# Altium project ADE-2ASK.PrjPcb
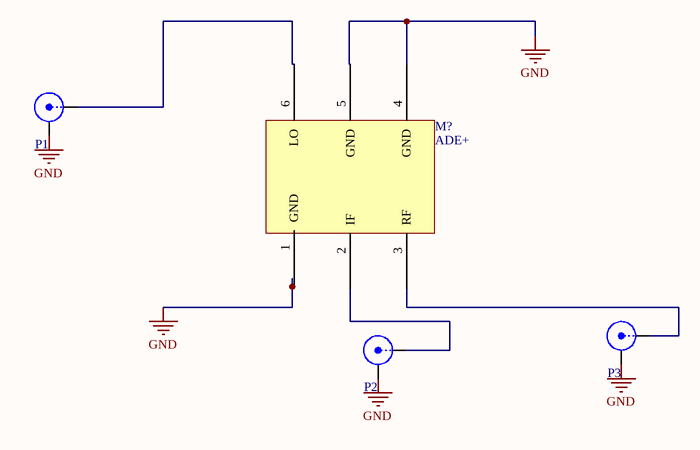
[diagram p0: ADE.SchDoc]
1 sheet, 4 parts. Net scope: global (net labels, ports and power ports of the same name join across sheets).
Board file: ADE.PcbDoc

## Sheet ADE.SchDoc
size A4

### Parts
M?  ADE+  [ADCH]
P1  SMA  [SMA]  (value not drawn)
P2  SMA  [SMA]  (value not drawn)
P3  SMA  [SMA]  (value not drawn)

### Nets
GND: M?.1(GND) M?.4(GND) M?.5(GND) P1.2(Y) P2.2(Y) P3.2(Y)
NetM?_2: M?.2(IF) P2.1(X)
NetM?_3: M?.3(RF) P3.1(X)
NetM?_6: M?.6(LO) P1.1(X)

### Library data of the parts
M? = ADE+: Mixer
P1-P3 = SMA: SMA Connector